# EAGLE design board (EAGLE 7.4.0)
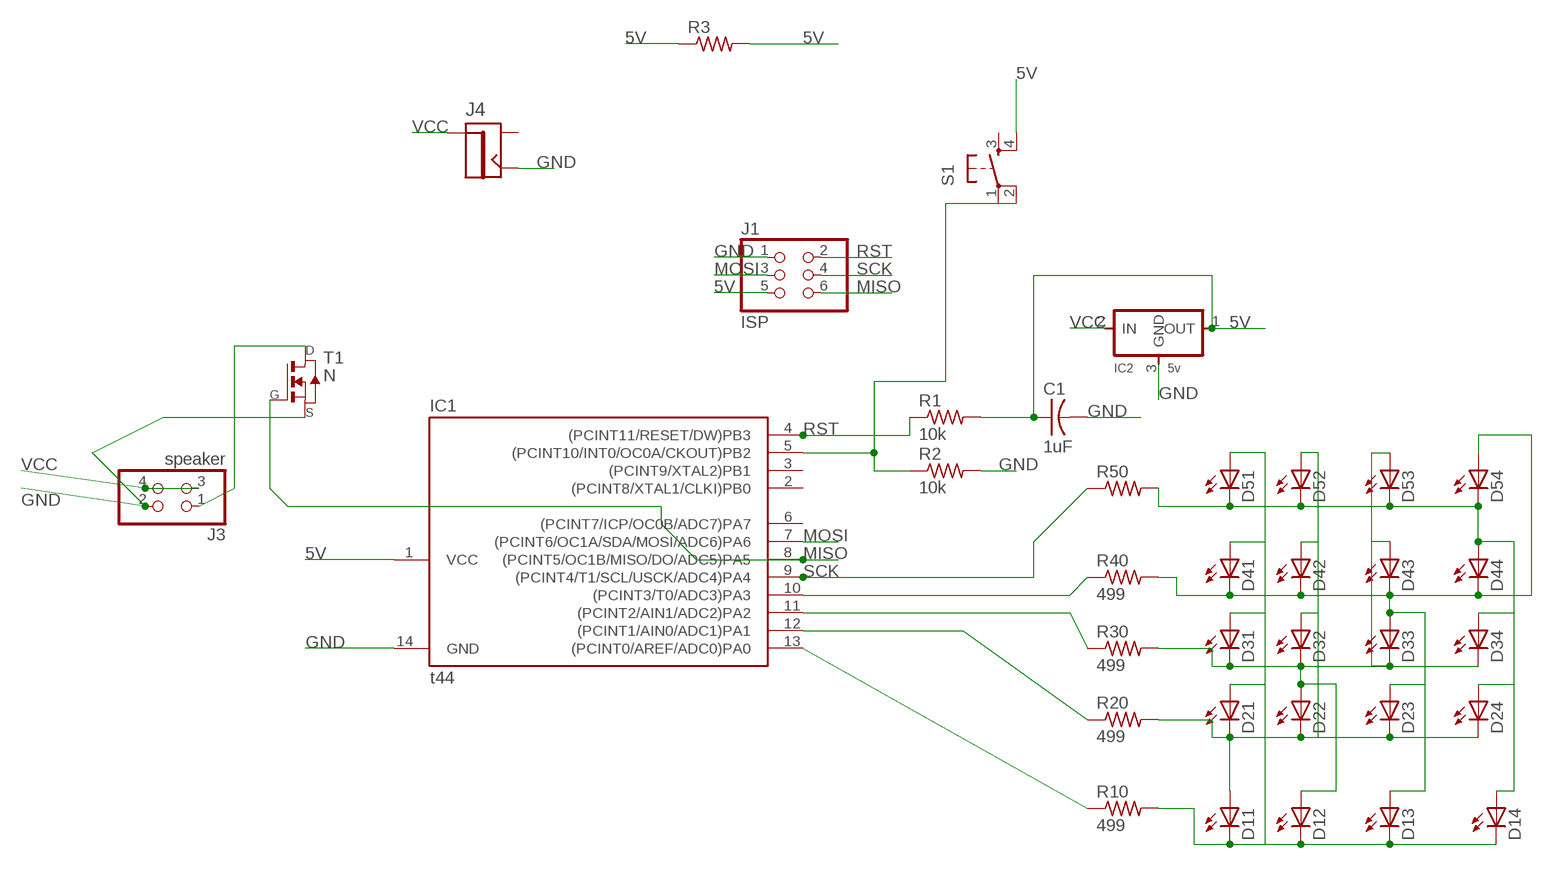
[diagram p0: schematic, sheet 1]

## Parts
C1  1uF  CAP-US1206FAB  [C1206FAB]
D11  LEDFAB1206  [LED1206FAB]
D12  LEDFAB1206  [LED1206FAB]
D13  LEDFAB1206  [LED1206FAB]
D14  LEDFAB1206  [LED1206FAB]
D21  LEDFAB1206  [LED1206FAB]
D22  LEDFAB1206  [LED1206FAB]
D23  LEDFAB1206  [LED1206FAB]
D24  LEDFAB1206  [LED1206FAB]
D31  LEDFAB1206  [LED1206FAB]
D32  LEDFAB1206  [LED1206FAB]
D33  LEDFAB1206  [LED1206FAB]
D34  LEDFAB1206  [LED1206FAB]
D41  LEDFAB1206  [LED1206FAB]
D42  LEDFAB1206  [LED1206FAB]
D43  LEDFAB1206  [LED1206FAB]
D44  LEDFAB1206  [LED1206FAB]
D51  LEDFAB1206  [LED1206FAB]
D52  LEDFAB1206  [LED1206FAB]
D53  LEDFAB1206  [LED1206FAB]
D54  LEDFAB1206  [LED1206FAB]
IC1  t44  ATTINY44-SSU  [SOIC14]
IC2  5v  REGULATORSOT23  [SOT23]
J1  ISP  PINHD-2X3-SMD  [2X03SMD]
J3  speaker  PINHD-2X2-SMD  [2X02SMD]
J4  JACK2.1MM  [JACK_2.1MM]
R1  10k  RES-US1206FAB  [R1206FAB]
R2  10k  RES-US1206FAB  [R1206FAB]
R3  RES-US1206FAB  [R1206FAB]
R10  499  RES-US1206FAB  [R1206FAB]
R20  499  RES-US1206FAB  [R1206FAB]
R30  499  RES-US1206FAB  [R1206FAB]
R40  499  RES-US1206FAB  [R1206FAB]
R50  RES-US1206FAB  [R1206FAB]
S1  6MM_SWITCH6MM_SWITCH  [6MM_SWITCH]
T1  N  NMOSFETSOT23  [SOT-23]

## Nets
5V: C1.1 IC1.1(VCC) IC2.1(OUT) J1.5 R1.2 R3.1 R3.2 S1.4(S1)
GND: C1.2 IC1.14(GND) IC2.3(GND) J1.1 J3.2 J4.CONTACT R2.2 T1.2(S)
MISO: IC1.8((PCINT5/OC1B/MISO/DO/ADC5)PA5) J1.6 T1.3(G)
MOSI: IC1.7((PCINT6/OC1A/SDA/MOSI/ADC6)PA6) J1.3
N$1: IC1.13((PCINT0/AREF/ADC0)PA0) R10.1
N$2: IC1.12((PCINT1/AIN0/ADC1)PA1) R20.1
N$3: IC1.11((PCINT2/AIN1/ADC2)PA2) R30.1
N$4: IC1.10((PCINT3/T0/ADC3)PA3) R40.1
N$6: D11.2(C) D12.2(C) D13.2(C) D14.2(C) D21.1(A) D31.1(A) D41.1(A) D51.1(A) R10.2
N$7: D11.1(A) D21.2(C) D22.2(C) D23.2(C) D24.2(C) D32.1(A) D42.1(A) D52.1(A) R20.2
N$8: J3.1 T1.1(D)
N$10: D12.1(A) D22.1(A) D31.2(C) D32.2(C) D33.2(C) D34.2(C) D43.1(A) D53.1(A) R30.2
N$11: D13.1(A) D23.1(A) D33.1(A) D41.2(C) D42.2(C) D43.2(C) D44.2(C) D54.1(A) R40.2
N$12: D14.1(A) D24.1(A) D34.1(A) D44.1(A) D51.2(C) D52.2(C) D53.2(C) D54.2(C) R50.2
N$14: IC1.5((PCINT10/INT0/OC0A/CKOUT)PB2) R2.1 S1.2(P1)
RST: IC1.4((PCINT11/RESET/DW)PB3) J1.2 R1.1
SCK: IC1.9((PCINT4/T1/SCL/USCK/ADC4)PA4) J1.4 R50.1
VCC: IC2.2(IN) J3.3 J3.4 J4.PIN
Unconnected: IC1.2((PCINT8/XTAL1/CLKI)PB0) IC1.3((PCINT9/XTAL2)PB1) IC1.6((PCINT7/ICP/OC0B/ADC7)PA7) J4.SHUNT S1.1(P) S1.3(S)

## Library data of the parts
C1 = fab:CAP-US
D11-D14 D21-D24 D31-D34 D41-D44 D51-D54 = fab:LED: LED
IC1 = fab:ATTINY44
IC2 = fab:REGULATOR
J1 = fab:PINHD-2X3-SMD: PIN HEADER
J3 = fab:PINHD-2X2-SMD
J4 = fab:JACK
R1-R3 R10 R20 R30 R40 R50 = fab:RES-US: Resistor (US Symbol) Variants with postfix FAB are widened to allow the routing of internal traces
S1 = fab:6MM_SWITCH: OMRON SWITCH
T1 = fab:NMOSFET: MOS FET

## Board
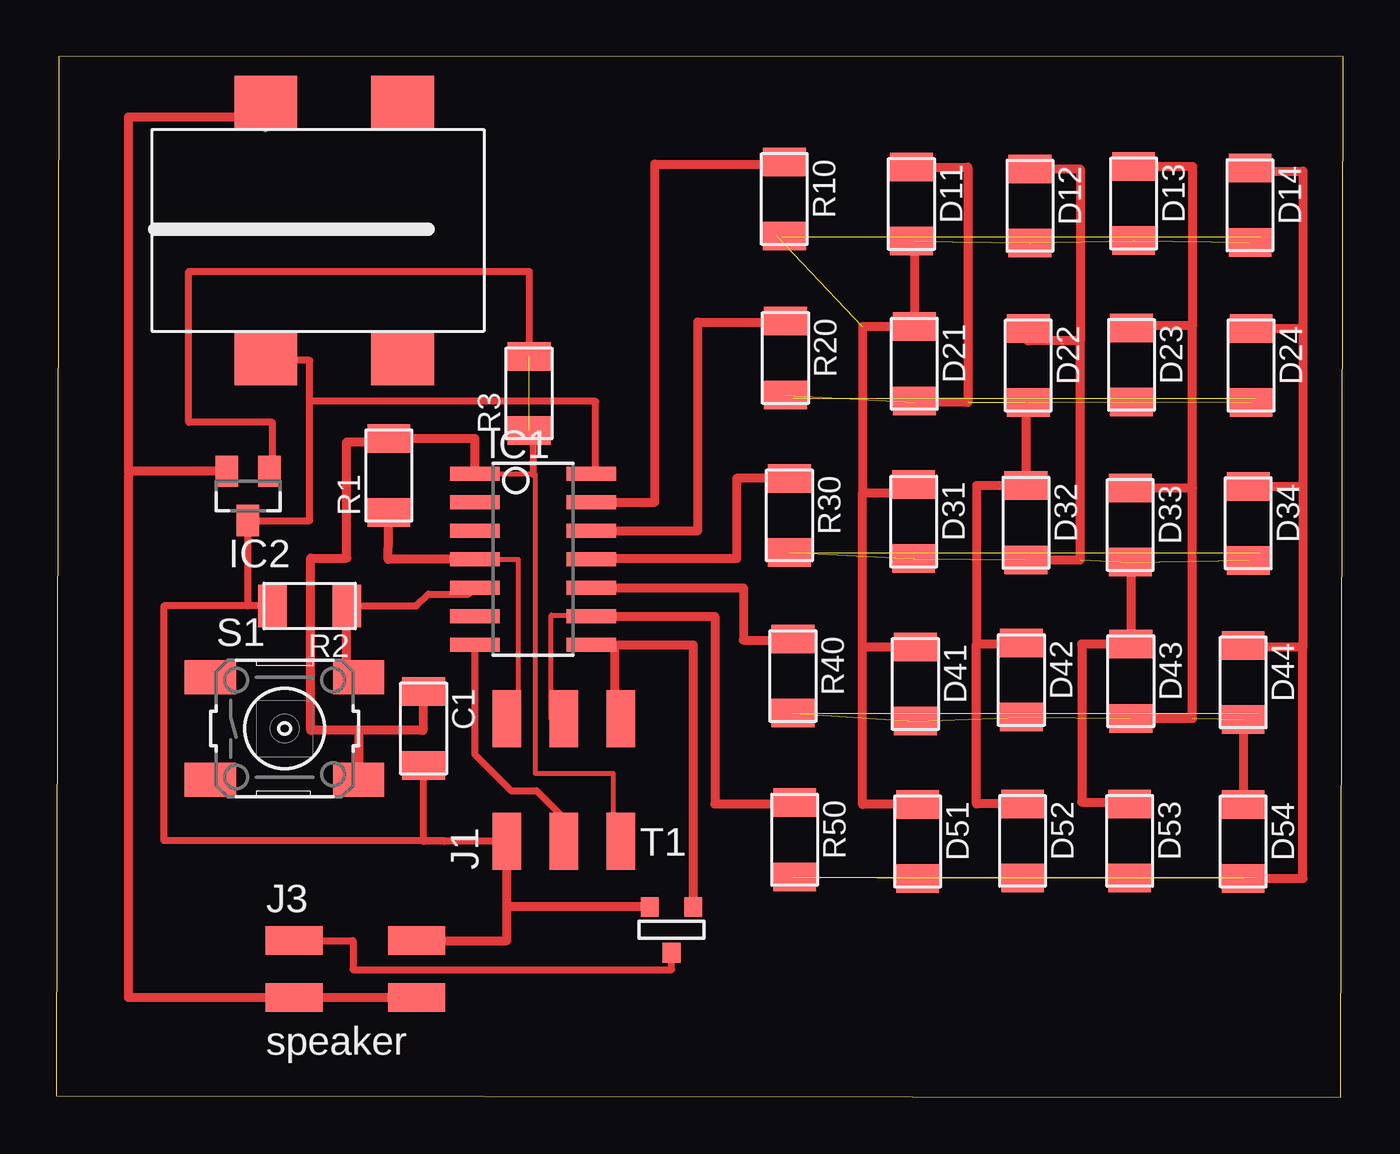
[diagram p1: board, top side]
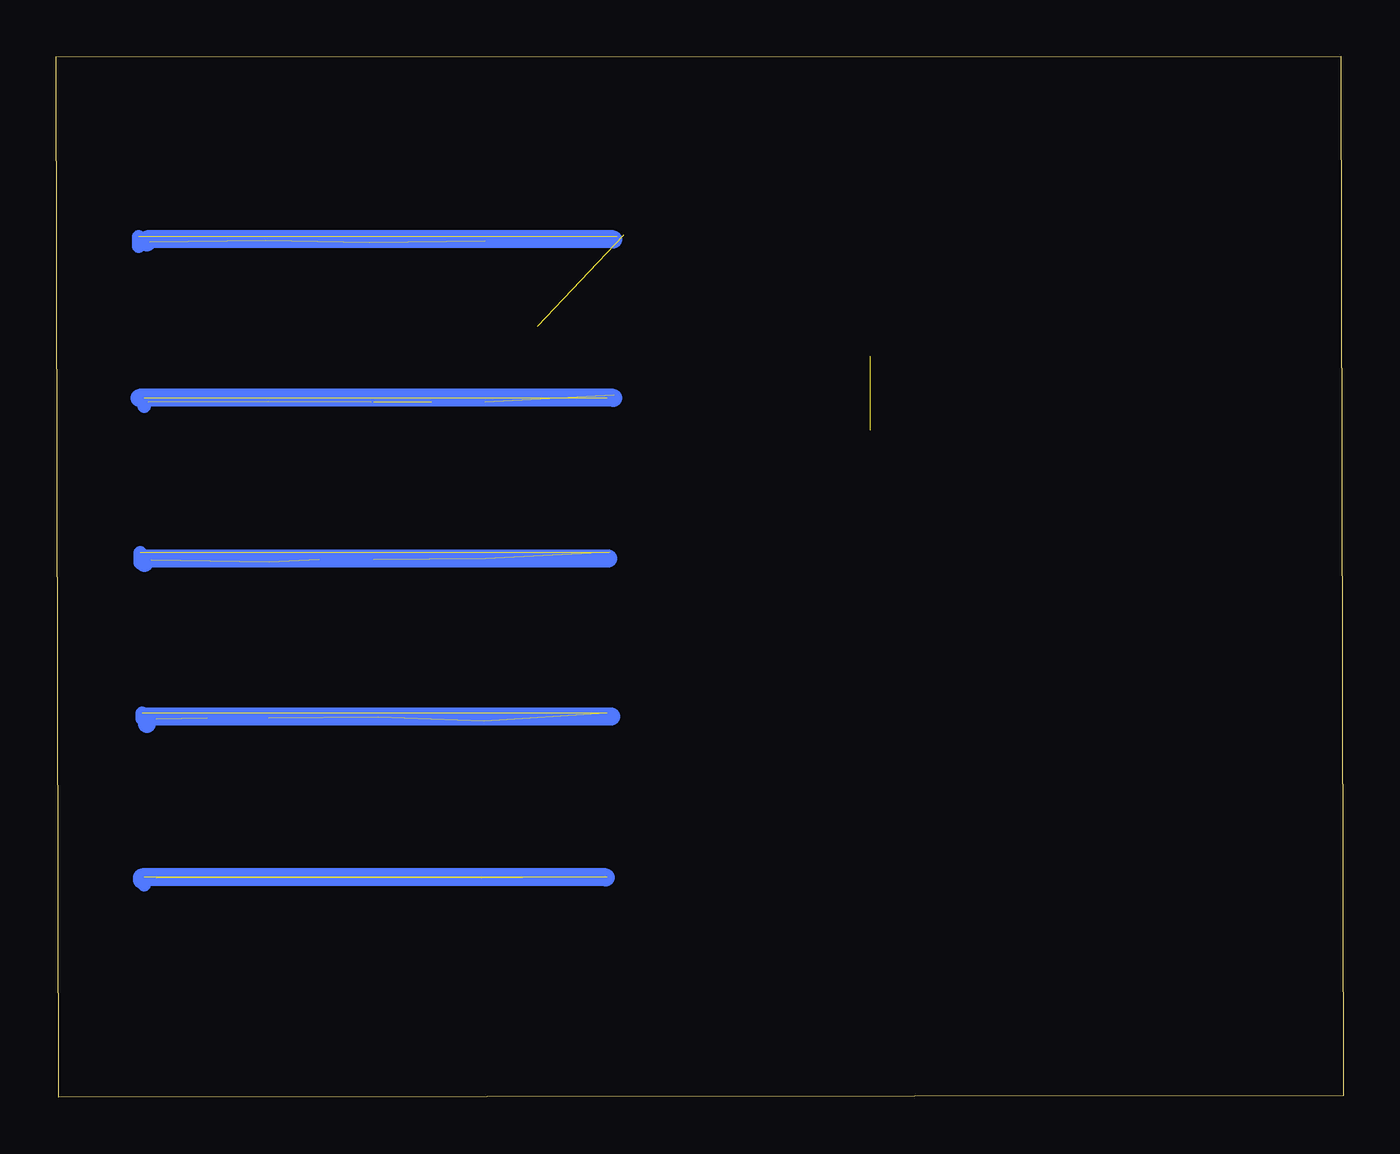
[diagram p2: board, bottom side, seen from below]

Size 57.38 x 46.4 mm. Coordinates in mm from the lower left corner, seen from the top.
Outline: 0,0.08 57.25,0 57.38,46.37 0.13,46.4 0,0.08
Copper layers 1+16: Top 0.035mm / dielectric 1.5mm / Bottom 0.035mm
Design rules "fablab_17mils": minimum track width 10mil, minimum drill 0.8mm, track to track 17mil, track to pad 17mil, pad to pad 17mil, via to via 17mil, smd to smd 17mil, copper to edge 16mil, drill to drill 16mil, minimum pad ring 0.8mm, minimum via ring 0.8mm, stop-mask expansion 4mil, vias tented up to drill 0mil, thermal gap 1mm

### Footprints (pad centres in the part's own frame; a part is rotated, then mirrored left to right if it is on the bottom)
C1206FAB = smd 1.27 x 1.905: 1 -1.651,0; 2 1.651,0
LED1206FAB = smd 1.27 x 1.905: 1 -1.651,0; 2 1.651,0
SOIC14 = smd 0.61 x 2.21: 1 -3.81,-2.603; 2 -2.54,-2.603; 3 -1.27,-2.603; 4 0,-2.603; 5 1.27,-2.603; 6 2.54,-2.603; 7 3.81,-2.603; 8 3.81,2.603; 9 2.54,2.603; 10 1.27,2.603; 11 0,2.603; 12 -1.27,2.603; 13 -2.54,2.603; 14 -3.81,2.603
SOT23 = smd 1 x 1.4: 1 -0.95,-1.1; 2 0.95,-1.1; 3 0,1.1
2X03SMD = smd 2.54 x 1.27: 1 -2.54,2.54; 2 2.92,2.54; 3 -2.54,0; 4 2.92,0; 5 -2.54,-2.54; 6 2.92,-2.54
2X02SMD = smd 2.54 x 1.27: 1 -2.54,1.27; 2 2.92,1.27; 3 -2.54,-1.27; 4 2.92,-1.27
JACK_2.1MM = smd 2.388 x 2.794: CONTACT 5.766,-2.413; PIN -5.639,-2.413; PIN1 -5.639,3.683; SHUNT 5.766,3.683
R1206FAB = smd 1.27 x 1.905: 1 -1.651,0; 2 1.651,0
6MM_SWITCH = smd 2.286 x 1.524: 1 -3.302,2.286; 2 3.302,2.286; 3 -3.302,-2.286; 4 3.302,-2.286
SOT-23 = smd 0.787 x 0.889: 1 0.025,-1.016; 2 -0.94,1.016; 3 0.991,1.016

### Placement (x,y rotation side)
C1  16.38,16.43 270 top
D11  38.13,39.8 270 top
D12  43.41,39.73 270 top
D13  48.03,39.83 270 top
D14  53.21,39.75 270 top
D21  38.25,32.69 270 top
D22  43.33,32.61 270 top
D23  47.93,32.64 270 top
D24  53.26,32.61 270 top
D31  38.23,25.65 270 top
D32  43.23,25.6 270 top
D33  47.88,25.5 270 top
D34  53.14,25.58 270 top
D41  38.3,18.42 270 top
D42  43.03,18.59 270 top
D43  47.9,18.54 270 top
D44  52.91,18.49 270 top
D51  38.4,11.4 270 top
D52  43.08,11.43 270 top
D53  47.85,11.43 270 top
D54  52.91,11.4 270 top
IC1  21.26,23.98 270 top
IC2  8.56,26.8 180 top
J1  22.63,13.94 90 top
J3  13.16,5.71 0 top
J4  11.76,38.68 270 top
R1  14.83,27.71 90 top
R2  11.3,21.89 180 top
R3  21.08,31.37 90 top
R10  32.46,40.03 270 top
R20  32.51,32.94 270 top
R30  32.69,25.93 270 top
R40  32.84,18.77 270 top
R50  32.92,11.48 270 top
S1  10.19,16.43 0 top
T1  27.41,7.47 0 top

### Tracks (layer width: path | path; a pad name or v marks a point on that pad's centre or on a via)
5V  (1 unrouted)
  Top 0.229: J1.5 24.84,11.4 24.84,14.43 21.36,14.43 21.36,27.76 21.26,27.76 18.66,27.76 IC1.1
  Top 0.305: IC2.1 9.65,27.9 9.65,30.07 5.92,30.07 5.92,36.8 21.08,36.8 R3.2 | R3.1 21.26,29.72 21.26,27.76
  Top 0.406: C1.1 16.36,18.08 16.36,16.36 13.49,16.36 | 13.49,16.36 S1.4 | IC1.1 18.66,29.36 R1.2 14.83,29.21 12.95,29.21 12.95,24.03 11.35,24.03 11.35,16.36 13.49,16.36
GND
  Top 0.305: 11.3,31.01 11.3,25.7 IC2.3 8.56,21.89 R2.2 4.8,21.89 4.8,11.46 17.3,11.46 17.3,11.4 | 11.3,31.01 11.3,32.84 9.35,32.84 J4.CONTACT | IC1.14 24.05,27.79 24.05,31.01 11.3,31.01 | J1.1 17.3,11.4 | 17.3,11.4 16.38,11.4 C1.2
  Top 0.406: J3.2 20.09,6.98 20.09,8.48 | T1.2 20.09,8.48 | 20.09,8.48 J1.1
MISO
  Top 0.406: IC1.8 24.92,20.17 | 24.92,20.17 28.4,20.17 T1.3 | J1.6 24.92,16.81 24.92,20.17
MOSI
  Top 0.305: IC1.7 18.66,15.28 20.27,13.67 21.41,13.67 22.96,12.12 22.96,10.97 22.91,10.92 22.91,11.13 J1.3
N$1
  Top 0.406: IC1.13 26.7,26.52 26.7,41.58 32.46,41.58 R10.1
N$2
  Top 0.406: IC1.12 28.6,25.25 28.6,34.54 33.22,34.54 33.22,34.47 32.51,34.47 R20.1
N$3
  Top 0.406: R30.1 30.33,27.58 30.33,24 23.56,24 IC1.11
N$4
  Top 0.406: IC1.10 30.63,22.71 30.63,20.37 32.84,20.37 R40.1
N$5  (1 unrouted)
  Bottom 0.61: 53.7,38.35 53.7,37.92
N$6  (4 unrouted)
  Top 0.406: D11.2 38.25,38.15 D21.1 35.94,34.34 35.94,26.95 | 35.94,26.95 38.23,26.95 D31.1 | D41.1 35.94,20.07 | 35.94,20.07 35.94,26.95 | D51.1 35.94,13.06 35.94,20.07 | R10.2 32.08,38.38 32.08,38.4
N$7  (4 unrouted)
  Top 0.406: D11.1 40.64,41.45 40.64,30.96 38.25,30.96 D21.2 | D22.2 43.23,30.96 D32.1 41.02,27.25 41.02,20.22 | 41.02,20.22 43.03,20.22 D42.1 | D52.1 41.02,13.08 41.02,20.22
N$8
  Top 0.305: J3.1 13.23,6.98 13.23,5.69 27.43,5.69 T1.1
N$9  (1 unrouted)
  Bottom 0.61: 53.44,31.14 53.44,30.78
N$10  (4 unrouted)
  Top 0.406: D12.1 45.64,41.38 45.64,33.71 | 45.64,33.71 43.33,33.71 D22.1 | D32.2 45.64,23.95 45.64,33.71 | D33.2 47.9,23.85 D43.1 45.72,20.19 45.72,13.16 47.85,13.16 D53.1
N$11  (4 unrouted)
  Top 0.406: D13.1 50.65,41.48 50.65,34.39 | 50.65,34.39 47.93,34.39 D23.1 | D33.1 50.65,27.15 | 50.65,27.15 50.65,34.39 | D43.2 50.65,16.89 50.65,27.15 | D44.2 D54.1
N$12  (4 unrouted)
  Top 0.406: D54.2 55.58,9.75 55.58,20.07 | 55.58,20.07 52.91,20.07 D44.1 | D34.1 55.58,27.23 | 55.58,27.23 55.58,20.07 | D24.1 55.58,34.26 | 55.58,34.26 55.58,27.23 | D14.1 53.21,41.27 55.58,41.27 55.58,34.26
N$13  (1 unrouted)
  Bottom 0.61: 53.62,24.26 53.62,23.83
N$14
  Top 0.305: R2.1 16.05,21.89 16.59,22.43 18.38,22.43 IC1.5
  Top 0.406: S1.2 12.95,18.72 R2.1
N$15  (1 unrouted)
  Bottom 0.61: 53.54,17.12 53.54,16.87
N$16  (1 unrouted)
  Bottom 0.61: 53.44,9.8 53.44,9.47
N$17
  Bottom 0.813: 32.54,38.23 53.34,38.23 53.34,38.1
N$18
  Bottom 0.813: 32.54,31.17 53.67,31.17
N$19
  Bottom 0.813: 32.77,24 53.44,24 53.44,23.8
N$20
  Bottom 0.813: 32.64,16.97 53.34,16.97 53.34,16.64
N$21
  Bottom 0.813: 32.87,9.8 53.54,9.8 53.54,9.68
RST
  Top 0.229: IC1.4 20.6,23.98 20.6,17.2 20.09,17.2 J1.2
  Top 0.406: IC1.4 14.81,23.98 R1.1
SCK
  Top 0.229: J1.4 22.07,16.86 22.07,21.49 23.86,21.49 IC1.9
  Top 0.406: IC1.9 29.36,21.44 29.36,13.08 32.92,13.08 R50.1
VCC
  Top 0.406: J3.4 J3.3 3.23,4.44 3.23,27.66 3.23,27.9 | J4.PIN 9.35,43.21 9.32,43.21 9.32,43.69 3.23,43.69 3.23,27.9 | IC2.2 3.23,27.9